# Altium schematic sheet [15] PushButtons.SchDoc: Push Buttons
size B; DocumentNumber: I; Revision: 01; SheetNumber: 15; SheetTotal: 19
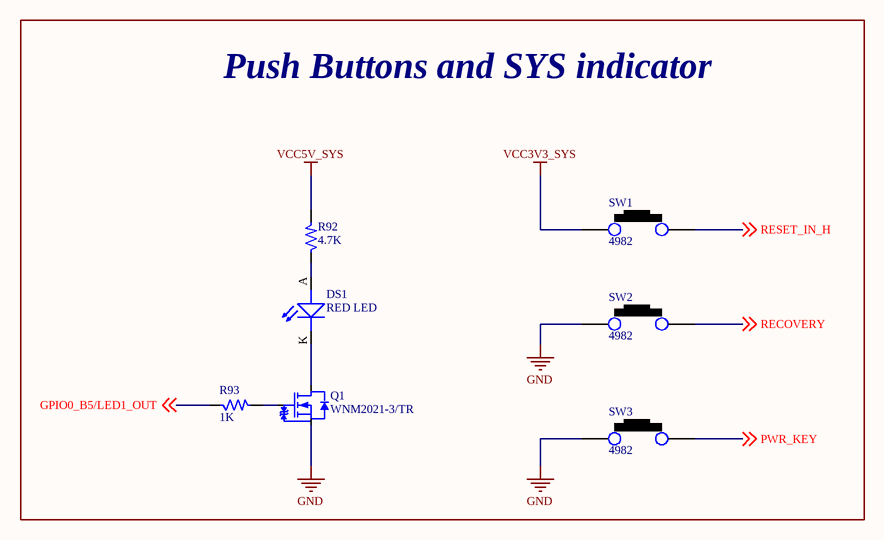
[diagram p0: [15] PushButtons.SchDoc]

## Parts
DS1  RED LED  [LED_0805]
Q1  WNM2021-3/TR  [SOT-323-3]
R92  4.7K  [RES_0201]
R93  1K  [RES_0201]
SW1  4982  [SW_177_39.3X77.7_SMD]
SW2  4982  [SW_177_39.3X77.7_SMD]
SW3  4982  [SW_177_39.3X77.7_SMD]

## Blocks framed on the sheet
Push Buttons and SYS indicator: DS1 Q1 R92 R93 SW1-SW3

## Nets
GND: Q1.2(S) SW2.1 SW3.1
VCC3V3_SYS: SW1.1
VCC5V_SYS: R92.2
GPIO0_B5/LED1_OUT: R93.1 ; off-sheet GPIO0_B5/LED1_OUT
PWR_KEY: SW3.2 ; off-sheet PWR_KEY
RECOVERY: SW2.2 ; off-sheet RECOVERY
RESET_IN_H: SW1.2 ; off-sheet RESET_IN_H
NetDS1_A: DS1.A(ANODE) R92.1
NetDS1_K: DS1.K(CATHODE) Q1.3(D)
NetQ1_1: Q1.1(G) R93.2

## Notes on the sheet
- Title
- Size:
- Date:
- B
- Number:
- Time:
- Revision:
- Sheet
- of
- File:

## Library data of the parts
DS1 = LED_RED-2V-20mA-0805: Red 631nm LED Indication - Discrete 2V 0805 (2012 Metric); Manufacturer: Vishay Lite-On; Manufacturer Part Number: LTST-C171KRKT; Case/Package: 0805; Supplier-1: SP ROAD
Q1 = MOSFET-N_20V-820mA-SOT-323: N Channel 20V 820mA 850mV @ 250uA 310mΩ @ 550mA,4.5V 310mW SOT-323(SC-70) MOSFET RoHS /; Manufacturer: WILLSEMI(Will Semicon); Manufacturer Part Number: WNM2021-3/TR; Case/Package: SOT-323(SC-70); Supplier-1: LCSC
R92 = RES_4.7K-0.1W-1%-0201: 4.02 kOhms ±1% 0.05W, 1/20W Chip Resistor 0201 (0603 Metric) Thick Film /; Manufacturer: Yageo; Manufacturer Part Number: RC0201FR-074K02L; Case/Package: 0201; Supplier-1: Digikey
R93 = RES_1K-0.05W-1%-0201: 1 kOhms ±1% 0.05W, 1/20W Chip Resistor 0201 (0603 Metric) Thick Film /; Manufacturer: Yageo; Manufacturer Part Number: RC0201FR-071KL; Case/Package: 0201; Supplier-1: Digikey
SW1-SW3 = SW1_4982: Tactile Switch 3x4x2mm SMD 2-Pin; Manufacturer: NA; Manufacturer Part Number: NA; Case/Package: SMD; Supplier-1: Sunrom